# Altium schematic sheet PowerAndSense.SchDoc
size A
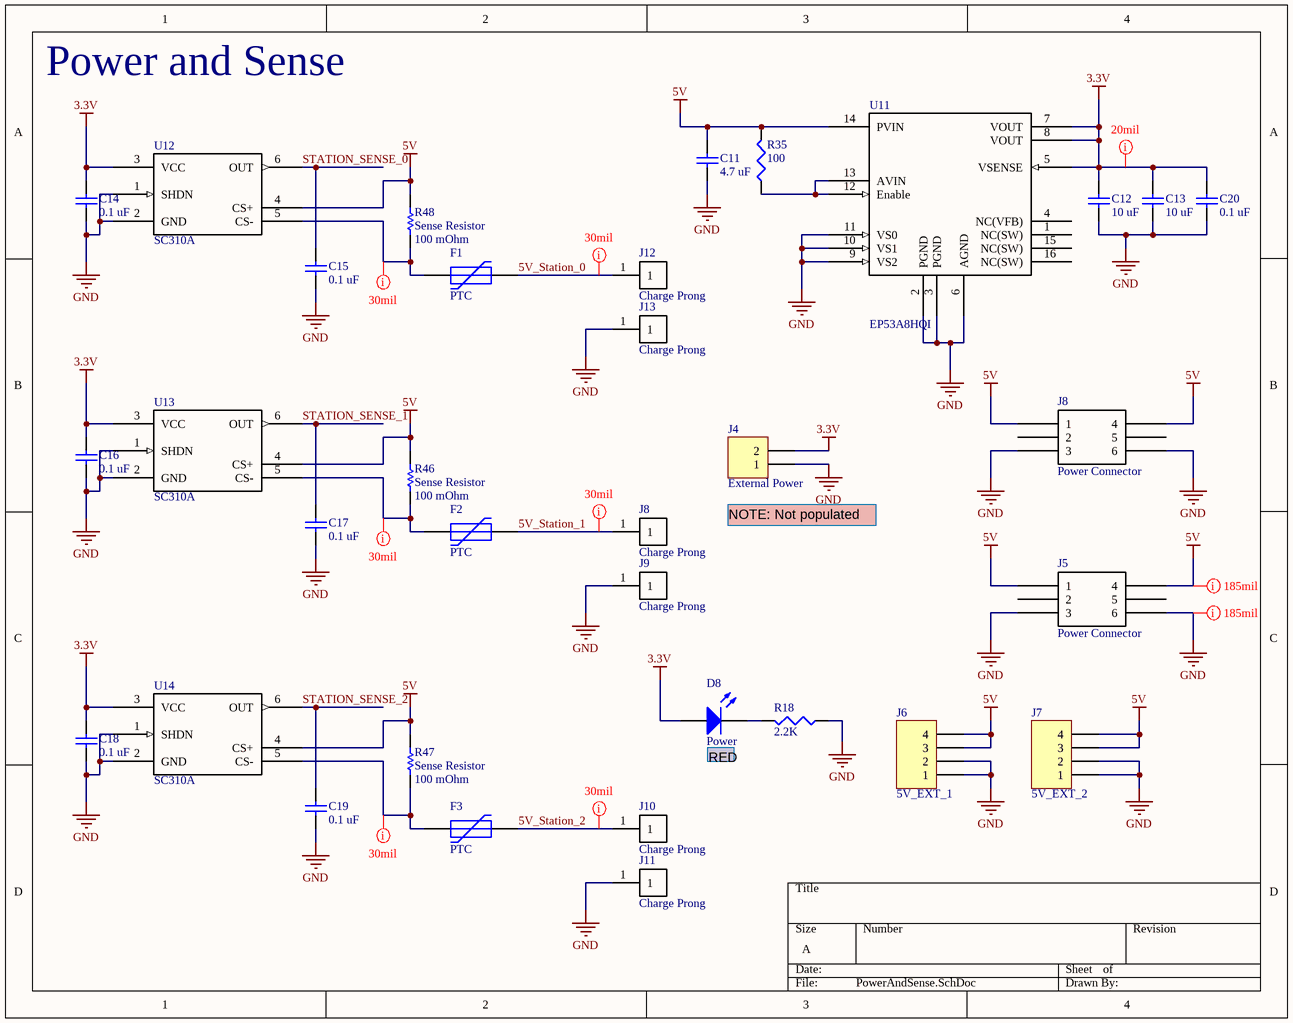
[diagram p0: PowerAndSense.SchDoc]

## Parts
(Parts that share a designator on the sheet are numbered #1, #2 ... from top to bottom, then left to right.)
C11  value 4.7 uF  [CAPC1608L]
C12  value 10 uF  [CAPC2012L]
C13  value 10 uF  [CAPC2012L]
C14  value 0.1 uF  [CAPC1005L]
C15  value 0.1 uF  [CAPC1005L]
C16  value 0.1 uF  [CAPC1005L]
C17  value 0.1 uF  [CAPC1005L]
C18  value 0.1 uF  [CAPC1005L]
C19  value 0.1 uF  [CAPC1005L]
C20  value 0.1 uF  [CAPC1005L]
D8  Power  [SurfaceMount(603)]
F1  PTC  [ERJ8G-1206]
F2  PTC  [ERJ8G-1206]
F3  PTC  [ERJ8G-1206]
J4  External Power  [HDR1X2]
J5  Power Connector  [MOLEX_MINI-FIT_JR_5569_2X3_HORIZ]
J6  5V_EXT_1  [HDR1X4]
J7  5V_EXT_2  [HDR1X4]
J8#1  Power Connector  [MOLEX_MINI-FIT_JR_5569_2X3_HORIZ]
J8#2  Charge Prong  [CHARGING_PRONG]
J9  Charge Prong  [CHARGING_PRONG]
J10  Charge Prong  [CHARGING_PRONG]
J11  Charge Prong  [CHARGING_PRONG]
J12  Charge Prong  [CHARGING_PRONG]
J13  Charge Prong  [CHARGING_PRONG]
R18  value 2.2K  [RESC1608L]  (hidden comment: Res3)
R35  value 100  [RESC1608L]  (hidden comment: Res3)
R46  Sense Resistor  value 100 mOhm  [ERJ8G-1206]
R47  Sense Resistor  value 100 mOhm  [ERJ8G-1206]
R48  Sense Resistor  value 100 mOhm  [ERJ8G-1206]
U11  EP53A8HQI  [QFN-16 - EP53A8xQI Package]
U12  SC310A  [SOT-23-6]
U13  SC310A  [SOT-23-6]
U14  SC310A  [SOT-23-6]

## Nets
3.3V: C12.2 C13.2 C14.2 C16.2 C18.2 C20.2 D8.1(A) J4.2 U11.5(VSENSE) U11.7(VOUT) U11.8(VOUT) U12.3(VCC) U13.3(VCC) U14.3(VCC)
5V: C11.2 J5.1 J5.4 J6.3 J6.4 J7.3 J7.4 J8#1.1 J8#1.4 R35.2 R46.2 R47.2 R48.2 U11.14(PVIN) U12.4(CS+) U13.4(CS+) U14.4(CS+)
GND: C11.1 C12.1 C13.1 C14.1 C15.1 C16.1 C17.1 C18.1 C19.1 C20.1 J4.1 J5.3 J5.6 J6.1 J6.2 J7.1 J7.2 J8#1.3 J8#1.6 J9.1 J11.1 J13.1 R18.1 U11.2(PGND) U11.3(PGND) U11.6(AGND) U11.9(VS2) U11.10(VS1) U11.11(VS0) U12.1(SHDN) U12.2(GND) U13.1(SHDN) U13.2(GND) U14.1(SHDN) U14.2(GND)
5V_Station_0: F1.2 J12.1
5V_Station_1: F2.2 J8#2.1
5V_Station_2: F3.2 J10.1
STATION_SENSE_0: C15.2 U12.6(OUT)
STATION_SENSE_1: C17.2 U13.6(OUT)
STATION_SENSE_2: C19.2 U14.6(OUT)
NetD8_2: D8.2(K) R18.2
NetF1_1: F1.1 R48.1 U12.5(CS-)
NetF2_1: F2.1 R46.1 U13.5(CS-)
NetF3_1: F3.1 R47.1 U14.5(CS-)
NetR35_1: R35.1 U11.12(Enable) U11.13(AVIN)

Not connected (* = marked no-connect by the designer): J5 2 5; J8#1 2 5; U11 1(NC(SW)) 4(NC(VFB)) 15(NC(SW)) 16(NC(SW))

## Layout directives
rule Width Constraint [Pref Width = 50mil    Min Width = 8mil    Max Width = 185mil]: GND
rule Width Constraint [Pref Width = 185mil    Min Width = 8mil    Max Width = 250mil]: 5V
rule Width Constraint [Pref Width = 30mil    Min Width = 15mil    Max Width = 100mil]: 5V_Station_0, 5V_Station_1, 5V_Station_2
rule Width Constraint [Pref Width = 20mil    Min Width = 8mil    Max Width = 100mil]: 3.3V
rule Width Constraint [Pref Width = 30mil    Min Width = 8mil    Max Width = 100mil]: NetF1_1, NetF2_1, NetF3_1

## Notes on the sheet
- Power and Sense
- (near J4) NOTE: Not populated
- (near D8) RED

## Library data of the parts
C11-C20 = Cap: Capacitor; Published: 8-Jun-2000; LatestRevisionDate: 17-Jul-2002; LatestRevisionNote: Re-released for DXP Platform.; PackageReference: RAD-0.3; Publisher: Altium Limited
D8 = LED
F1-F3 = PTC_FUSE: Fuse; Published: 8-Jun-2000; LatestRevisionDate: 17-Jul-2002; LatestRevisionNote: Re-released for DXP Platform.; PackageReference: PIN-W2/E2.8; Publisher: Altium Limited
J4 = Header 2: Header, 2-Pin; LatestRevisionDate: 17-Jul-2002; LatestRevisionNote: Re-released for DXP Platform.; Publisher: Altium Limited
J5 J8#1 = MOLEX_MINI_FIT_JR_2X3
J6 J7 = Header 4: Header, 4-Pin; LatestRevisionDate: 17-Jul-2002; LatestRevisionNote: Re-released for DXP Platform.; Publisher: Altium Limited
J8#2 J9-J13 = CHARGE_PRONG: Charging Prong Hole with Plating
R18 R35 = Res3: Resistor; Published: 8-Jun-2000; LatestRevisionDate: 29-May-2009; LatestRevisionNote: IPC-7351 Footprint Added.; PackageReference: J1-0603; Publisher: Altium Limited; PackageDescription: Chip Resistor
R46-R48 = Resistor: Published: 8-Jun-2000; LatestRevisionDate: 17-Jul-2002; LatestRevisionNote: Re-released for DXP Platform.; PackageReference: AXIAL-0.3; Publisher: Altium Limited; PackageDescription: Axial Device, Thru-Hole; 2 Leads; 0.3 in Pin Spacing
U11 = EP53A8HQI: DC/DC Converter with Integrated Inductor
U12-U14 = SC310A: High-Side Current-Sense Amplifier with Low Impedance Voltage Output